# EAGLE design receiver (EAGLE 6.6.0)
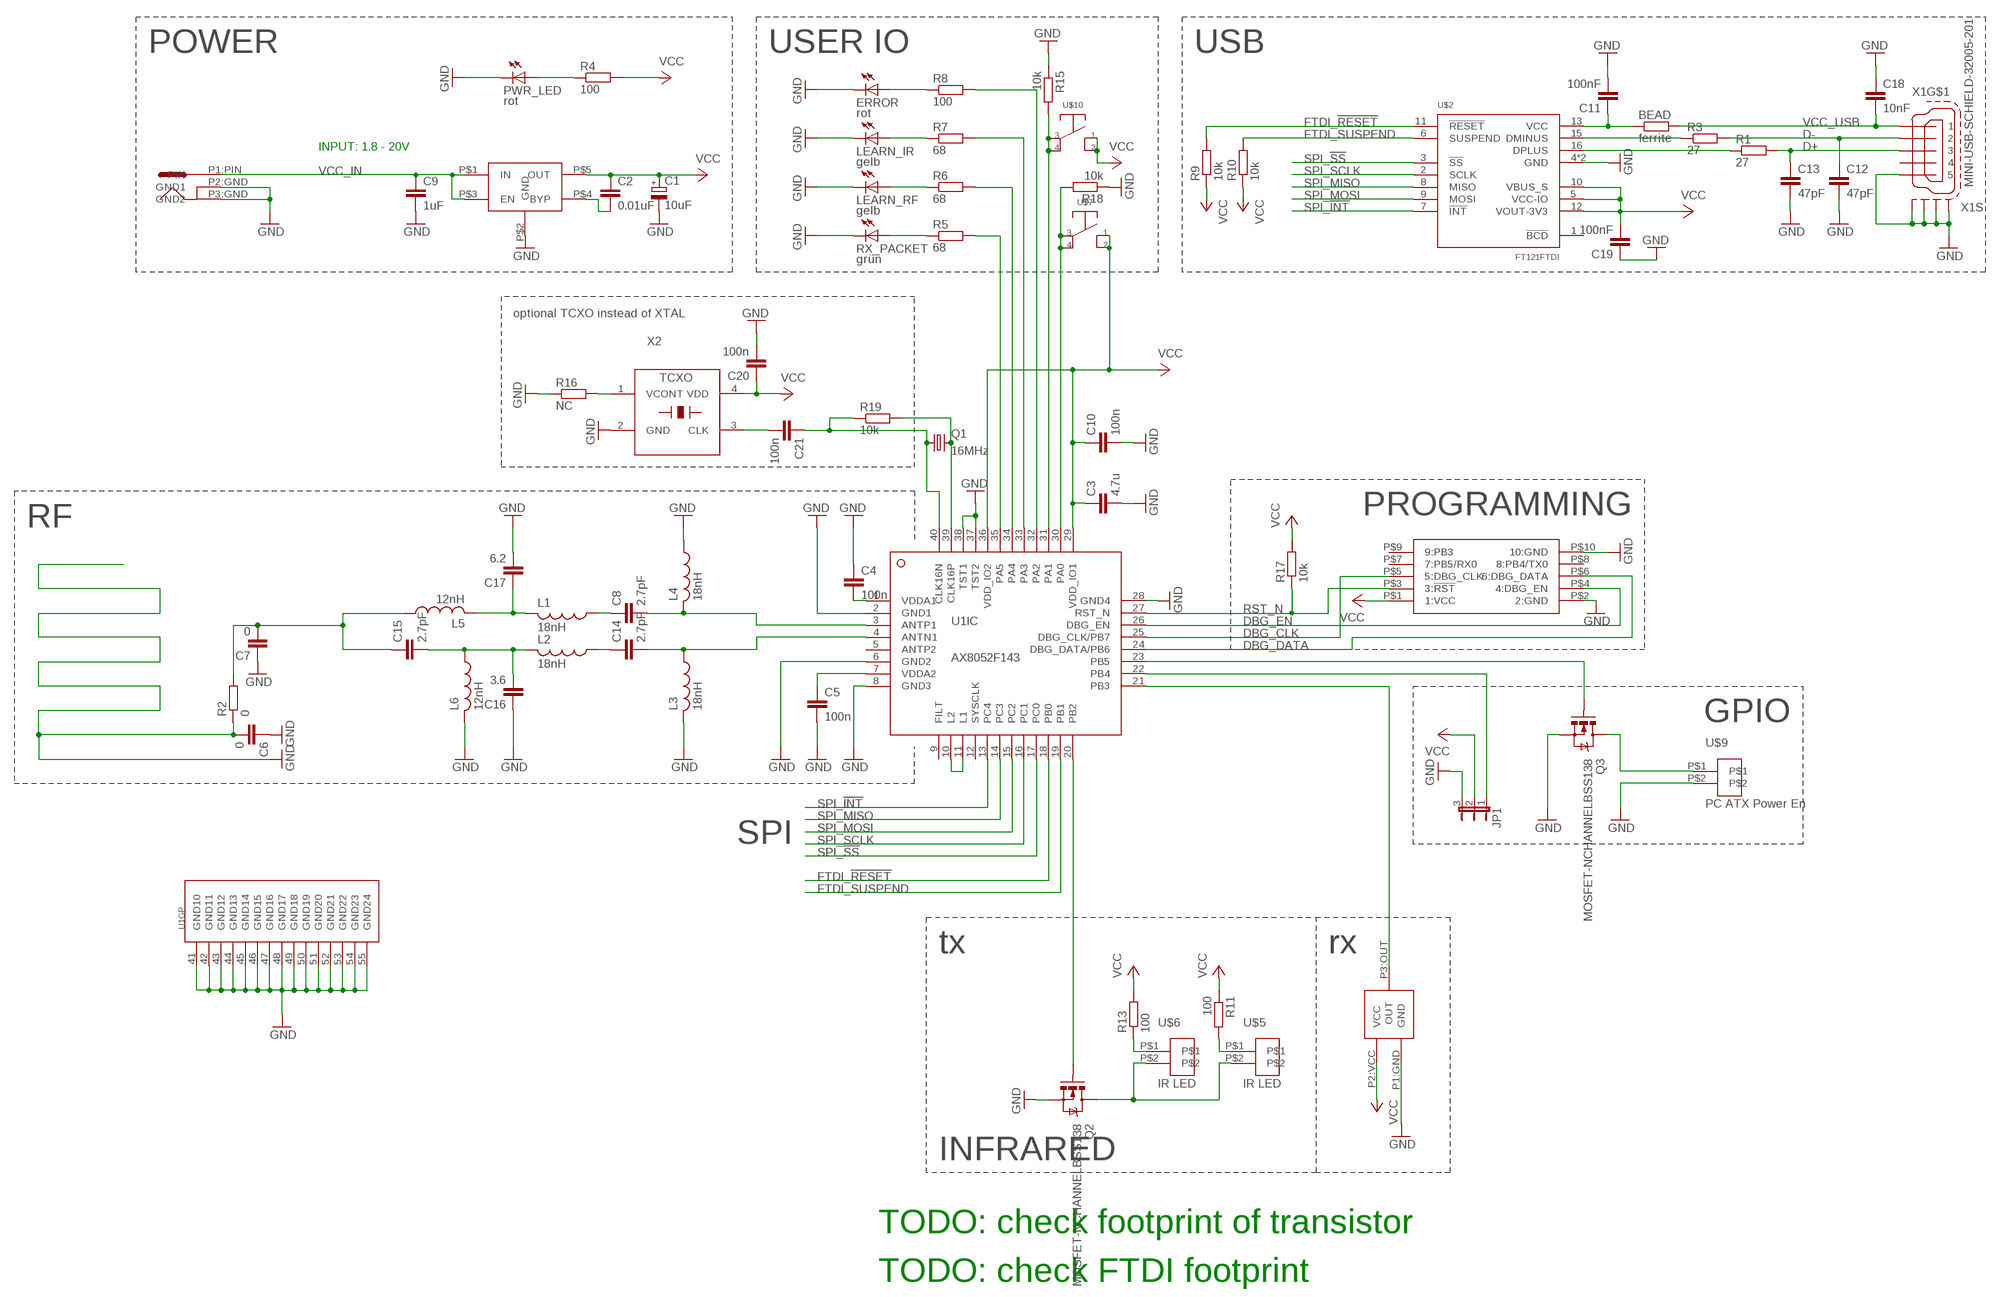
[diagram p0: schematic, sheet 1]

## Parts
BEAD  ferrite  R-EU_R0603  [R0603]
C1  10uF  CPOL-EU153CLV-0405  [153CLV-0405]
C2  0.01uF  C-EUC0603  [C0603]
C3  4.7u  C-EUC0805  [C0805]
C4  100n  C-EUC0603  [C0603]
C5  100n  C-EUC0603  [C0603]
C6  0  C-EUC0603  [C0603]
C7  0  C-EUC0603  [C0603]
C8  2.7pF  C-EUC0603  [C0603]
C9  1uF  C-EUC0805K  [C0805K]
C10  100n  C-EUC0603  [C0603]
C11  100nF  C-EUC0603K  [C0603K]
C12  47pF  C-EUC0603K  [C0603K]
C13  47pF  C-EUC0603K  [C0603K]
C14  2.7pF  C-EUC0603  [C0603]
C15  2.7pF  C-EUC0603  [C0603]
C16  3.6  C-EUC0603  [C0603]
C17  6.2  C-EUC0603  [C0603]
C18  10nF  C-EUC0603K  [C0603K]
C19  100nF  C-EUC0603K  [C0603K]
C20  100n  C-EUC0603  [C0603]
C21  100n  C-EUC0603  [C0603]
ERROR  rot  LEDCHIPLED_1206  [CHIPLED_1206]
JP1  JP2E  [JP2]
L1  18nH  L-US0603  [C0603]
L2  18nH  L-US0603  [C0603]
L3  18nH  L-US0603  [C0603]
L4  18nH  L-US0603  [C0603]
L5  12nH  L-US0603  [C0603]
L6  12nH  L-US0603  [C0603]
LEARN_IR  gelb  LEDCHIPLED_1206  [CHIPLED_1206]
LEARN_RF  gelb  LEDCHIPLED_1206  [CHIPLED_1206]
PWR_LED  rot  LEDCHIPLED_1206  [CHIPLED_1206]
Q1  16MHz  CRYSTALSM49  [SM49]
Q2  MOSFET-NCHANNELBSS138  [SOT23]
Q3  MOSFET-NCHANNELBSS138  [SOT23]
R1  27  R-EU_R0603  [R0603]
R2  0  R-EU_R0603  [R0603]
R3  27  R-EU_R0603  [R0603]
R4  100  R-EU_R0603  [R0603]
R5  68  R-EU_R0603  [R0603]
R6  68  R-EU_R0603  [R0603]
R7  68  R-EU_R0603  [R0603]
R8  100  R-EU_R0603  [R0603]
R9  10k  R-EU_R0603  [R0603]
R10  10k  R-EU_R0603  [R0603]
R11  100  R-EU_R0603  [R0603]
R13  100  R-EU_R0603  [R0603]
R15  10k  R-EU_R0603  [R0603]
R16  NC  R-EU_R0603  [R0603]
R17  10k  R-EU_R0603  [R0603]
R18  10k  R-EU_R0603  [R0603]
R19  10k  R-EU_R0603  [R0603]
RX_PACKET  grün  LEDCHIPLED_1206  [CHIPLED_1206]
U1  AX8052F143HS  [QFN40-H]
U$1  LT1761  [TSOT-23]
U$2  FT121FTDI  [TSSOP16-FTDI]
U$3  2X5PIN-CONNECTOR  [2X5PIN-CONNECTOR-SMD]
U$4  POWER_JACK  [POWER_JACK_3.4/1]
U$5  IR LED  2PIN-CONNECTOR2.57RASTER  [2PIN_PINHEADER]
U$6  IR LED  2PIN-CONNECTOR2.57RASTER  [2PIN_PINHEADER]
U$7  SWITCHSMD  [TACTILE_SWITCH_FSM2JSMA]
U$8  IR_RECEIVER  [TSOP1738_IR_RECV]
U$9  PC ATX Power En  2PIN-CONNECTOR2.57RASTER  [2PIN_PINHEADER]
U$10  SWITCHSMD  [TACTILE_SWITCH_FSM2JSMA]
X1  MINI-USB-SCHIELD-32005-201  [32005-201]
X2  TCXO3225  [X3225]

## Nets
D+: C13.1 R1.2 X1.3
D-: C12.1 R3.2 X1.2
DBG_CLK: U1.25(IC:DBG_CLK/PB7) U$3.P$5(5:DBG_CLK)
DBG_DATA: U1.24(IC:DBG_DATA/PB6) U$3.P$6(6:DBG_DATA)
DBG_EN: U1.26(IC:DBG_EN) U$3.P$4(4:DBG_EN)
FTDI_!RESET: R9.2 U1.18(IC:PB0) U$2.11(!RESET)
FTDI_SUSPEND: R10.2 U1.19(IC:PB1) U$2.6(SUSPEND)
GND: C1.- C3.2 C4.1 C5.2 C6.1 C6.2 C7.1 C9.2 C10.2 C11.2 C12.2 C13.2 C16.1 C17.2 C18.1 C19.1 C20.2 ERROR.C JP1.3 L3.2 L4.1 L6.2 LEARN_IR.C LEARN_RF.C PWR_LED.C Q2.2(S) Q3.2(S) R2.1 R15.1 R16.1 R18.1 RX_PACKET.C U1.2(IC:GND1) U1.6(IC:GND2) U1.8(IC:GND3) U1.28(IC:GND4) U1.37(IC:TST2) U1.38(IC:TST1) U1.41(GP:GND10) U1.42(GP:GND11) U1.43(GP:GND12) U1.44(GP:GND13) U1.45(GP:GND14) U1.46(GP:GND15) U1.47(GP:GND16) U1.48(GP:GND17) U1.49(GP:GND18) U1.50(GP:GND19) U1.51(GP:GND20) U1.52(GP:GND21) U1.53(GP:GND22) U1.54(GP:GND23) U1.55(GP:GND24) U$1.P$2(GND) U$2.4(GND) U$2.14(GND) U$3.P$2(2:GND) U$3.P$10(10:GND) U$4.P2:GND(GND1) U$4.P3:GND(GND2) U$8.P1:GND(GND) U$9.P$2 X1.5 X1.M1(S:S1) X1.M2(S:S2) X1.M3(S:S3) X1.M4(S:S4) X2.2(GND)
N$1: U1.10(IC:L2) U1.11(IC:L1)
N$2: R1.1 U$2.16(DPLUS)
N$3: C4.2 U1.1(IC:VDDA1)
N$4: C2.2 U$1.P$4(BYP)
N$5: R3.1 U$2.15(DMINUS)
N$6: C5.1 U1.7(IC:VDDA2)
N$7: C8.2 L4.2 U1.3(IC:ANTP1)
N$8: C14.2 L3.1 U1.4(IC:ANTN1)
N$9: C8.1 L1.1
N$10: C14.1 L2.1
N$11: BEAD.1 C11.1 U$2.13(VCC)
N$12: C17.1 L1.2 L5.2
N$13: C15.2 C16.2 L2.2 L6.1
N$14: Q1.2 R19.2 U1.39(IC:CLK16P)
N$15: C21.1 Q1.1 R19.1 U1.40(IC:CLK16N)
N$16: JP1.1 U1.22(IC:PB4)
N$17: R15.2 U1.31(IC:PA1) U$10.P3 U$10.P4
N$18: PWR_LED.A R4.1
N$19: R16.2 X2.1(VCONT)
N$20: C7.2 C15.1 L5.1 R2.2
N$21: U1.21(IC:PB3) U$8.P3:OUT(OUT)
N$22: C21.2 X2.3(CLK)
N$25: R5.1 RX_PACKET.A
N$26: R5.2 U1.35(IC:PA5)
N$27: R18.2 U1.30(IC:PA0) U$7.P3 U$7.P4
N$28: LEARN_RF.A R6.1
N$29: LEARN_IR.A R7.1
N$30: ERROR.A R8.1
N$31: R6.2 U1.34(IC:PA4)
N$32: R7.2 U1.33(IC:PA3)
N$33: R8.2 U1.32(IC:PA2)
N$37: R11.2 U$5.P$1
N$40: R13.1 U$6.P$1
N$41: Q2.3(D) U$5.P$2 U$6.P$2
N$42: Q2.1(G) U1.20(IC:PB2)
N$47: Q3.1(G) U1.23(IC:PB5)
N$48: Q3.3(D) U$9.P$1
RST_N: R17.1 U1.27(IC:RST_N) U$3.P$3(3:!RST)
SPI_!INT: U1.13(IC:PC4) U$2.7(!INT)
SPI_!SS: U1.17(IC:PC0) U$2.3(!SS)
SPI_MISO: U1.14(IC:PC3) U$2.8(MISO)
SPI_MOSI: U1.15(IC:PC2) U$2.9(MOSI)
SPI_SCLK: U1.16(IC:PC1) U$2.2(SCLK)
VCC: C1.+ C2.1 C3.1 C10.1 C19.2 C20.1 JP1.2 R4.2 R9.1 R10.1 R11.1 R13.2 R17.2 U1.29(IC:VDD_IO1) U1.36(IC:VDD_IO2) U$1.P$5(OUT) U$2.5(VCC-IO) U$2.10(VBUS_S) U$2.12(VOUT-3V3) U$3.P$1(1:VCC) U$7.P1 U$7.P2 U$8.P2:VCC(VCC) U$10.P1 U$10.P2 X2.4(VDD)
VCC_IN: C9.1 U$1.P$1(IN) U$1.P$3(EN) U$4.P1:PIN(PIN)
VCC_USB: BEAD.2 C18.2 X1.1
Unconnected: U1.5(IC:ANTP2) U1.9(IC:FILT) U1.12(IC:SYSCLK) U$2.1(!BCD) U$3.P$7(7:PB5/RX0) U$3.P$8(8:PB4/TX0) U$3.P$9(9:PB3) X1.4

## Notes on the sheet
- POWER | USER IO | USB
- INPUT: 1.8 - 20V
- optional TCXO instead of XTAL
- PROGRAMMING
- RF
- GPIO
- SPI
- tx | rx
- INFRARED
- TODO: check footprint of transistor
- TODO: check FTDI footprint

## Library data of the parts
BEAD R1-R11 R13 R15-R19 = resistor:R-EU_: RESISTOR, European symbol
C1 = resistor:CPOL-EU: POLARIZED CAPACITOR, European symbol
C2-C21 = resistor:C-EU: CAPACITOR, European symbol
ERROR LEARN_IR LEARN_RF PWR_LED RX_PACKET = led:LED: LED OSRAM: - CHIPLED LG R971, LG N971, LY N971, LG Q971, LY Q971, LO R971, LY R971 LH N974, LH R974 LS Q976, LO Q976, LY Q976 LO Q996 - Hyper CHIPLED LW Q18S LB Q993, LB Q99A, LB R99A - SideLED LS A670, LO A670, LY A670, LG A670, LP A670 LB A673, LV A673, LT A673, LW A673 LH A674 LY A675 LS A676, LA A676, LO A676, LY A676, LW A676 LS A679, LY A679, LG A679 - Hyper Micro SIDELED® LS Y876, LA Y876, LO Y876, LY Y876 LT Y87S - SmartLED LW L88C, LW L88S LB L89C, LB L89S, LG L890 LS L89K, LO L89K, LY L89K LS L896, LA L896, LO L896, LY L896 - TOPLED LS T670, LO T670, LY T670, LG T670, LP T670 LSG T670, LSP T670, LSY T670, LOP T670, LYG T670 LG T671, LOG T671, LSG T671 LB T673, LV T673, LT T673, LW T673 LH T674 LS T676, LA T676, LO T676, LY T676, LB T676, LH T676, LSB T676, LW T676 LB T67C, LV T67C, LT T67C, LS T67K, LO T67K, LY T67K, LW E67C LS E67B, LA E67B, LO E67B, LY E67B, LB E67C, LV E67C, LT E67C LW T67C LS T679, LY T679, LG T679 LS T770, LO T770, LY T770, LG T770, LP T770 LB T773, LV T773, LT T773, LW T773 LH T774 LS E675, LA E675, LY E675, LS T675 LS T776, LA T776, LO T776, LY T776, LB T776 LHGB T686 LT T68C, LB T68C - Hyper Mini TOPLED® LB M676 - Mini TOPLED Santana® LG M470 LS M47K, LO M47K, LY M47K Source: http://www.osram.convergy.de LUXEON: - LUMILED® LXK2-PW12-R00, LXK2-PW12-S00, LXK2-PW14-U00, LXK2-PW14-V00 LXK2-PM12-R00, LXK2-PM12-S00, LXK2-PM14-U00 LXK2-PE12-Q00, LXK2-PE12-R00, LXK2-PE12-S00, LXK2-PE14-T00, LXK2-PE14-U00 LXK2-PB12-K00, LXK2-PB12-L00, LXK2-PB12-M00, LXK2-PB14-N00, LXK2-PB14-P00, LXK2-PB14-Q00 LXK2-PR12-L00, LXK2-PR12-M00, LXK2-PR14-Q00, LXK2-PR14-R00 LXK2-PD12-Q00, LXK2-PD12-R00, LXK2-PD12-S00 LXK2-PH12-R00, LXK2-PH12-S00 LXK2-PL12-P00, LXK2-PL12-Q00, LXK2-PL12-R00 Source: www.luxeon.com KINGBRIGHT: KA-3528ASYC Source: www.kingbright.com
JP1 = jumper:JP2E: JUMPER
L1-L6 = resistor:L-US: INDUCTOR, American symbol
Q1 = crystal:CRYSTAL: CRYSTAL
Q2 Q3 = SparkFun-DiscreteSemi:MOSFET-NCHANNEL: Common NMOSFET Parts MFG P/N Store ID Prod ID FDD8780 TRANS-09984 SI7820DN TRANS-11055 FDS6630A IC-08089 2N7002PW TRANS-11151 FQP30N06L COM-10213 TRANS-10060 BSS123LT1G TRANS-08345 BSS138 TRANS-00830 BS170 2N7000; PROD_ID: TRANS-00830
U1 = axsem_v4-11:AX8052F143: Ultra cool AXSEM low-power narrow-band transceiver with integrated ultra-low-power AX8052 micro-controller
U$1 = sam_eagle_parts:LT1761
U$2 = sam:FT121: FT121 - USB Device Controller with SPI Slave FOOTPRINT IS PROBABLY WRONG - Use with caution! http://www.ftdichip.com/Products/ICs/FT121.html
U$3 = sam_eagle_parts:2X5PIN-CONNECTOR
U$4 = sam_eagle_parts:POWER_JACK
U$5 U$6 U$9 = sam_eagle_parts:2PIN-CONNECTOR
U$7 U$10 = sam:SWITCH
U$8 = sam_eagle_parts:IR_RECEIVER
X1 = con-cypressindustries:MINI-USB-SCHIELD-: MINI USB-B Conector Source: www.cypressindustries.com; OC_FARNELL: unknown; OC_NEWARK: unknown
X2 = axsem_osc_v1-2:TCXO

## Net classes
0 default: clearance 0.205 mm

## Board
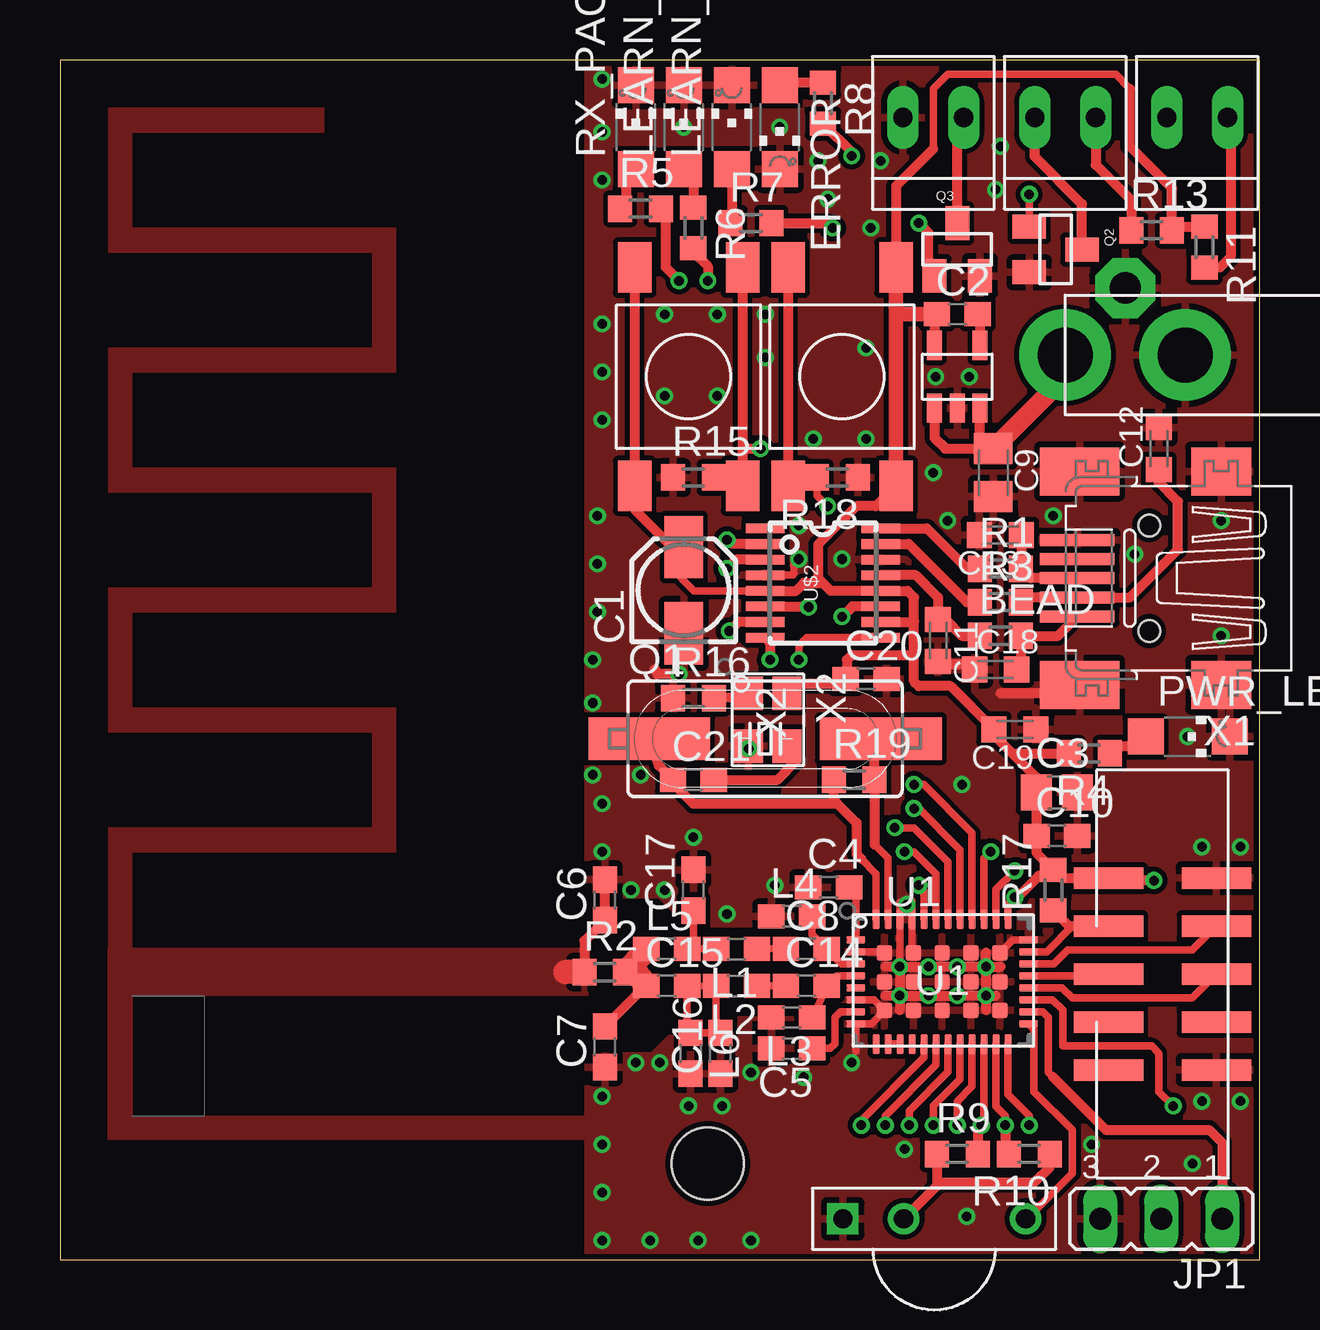
[diagram p1: board, top side]
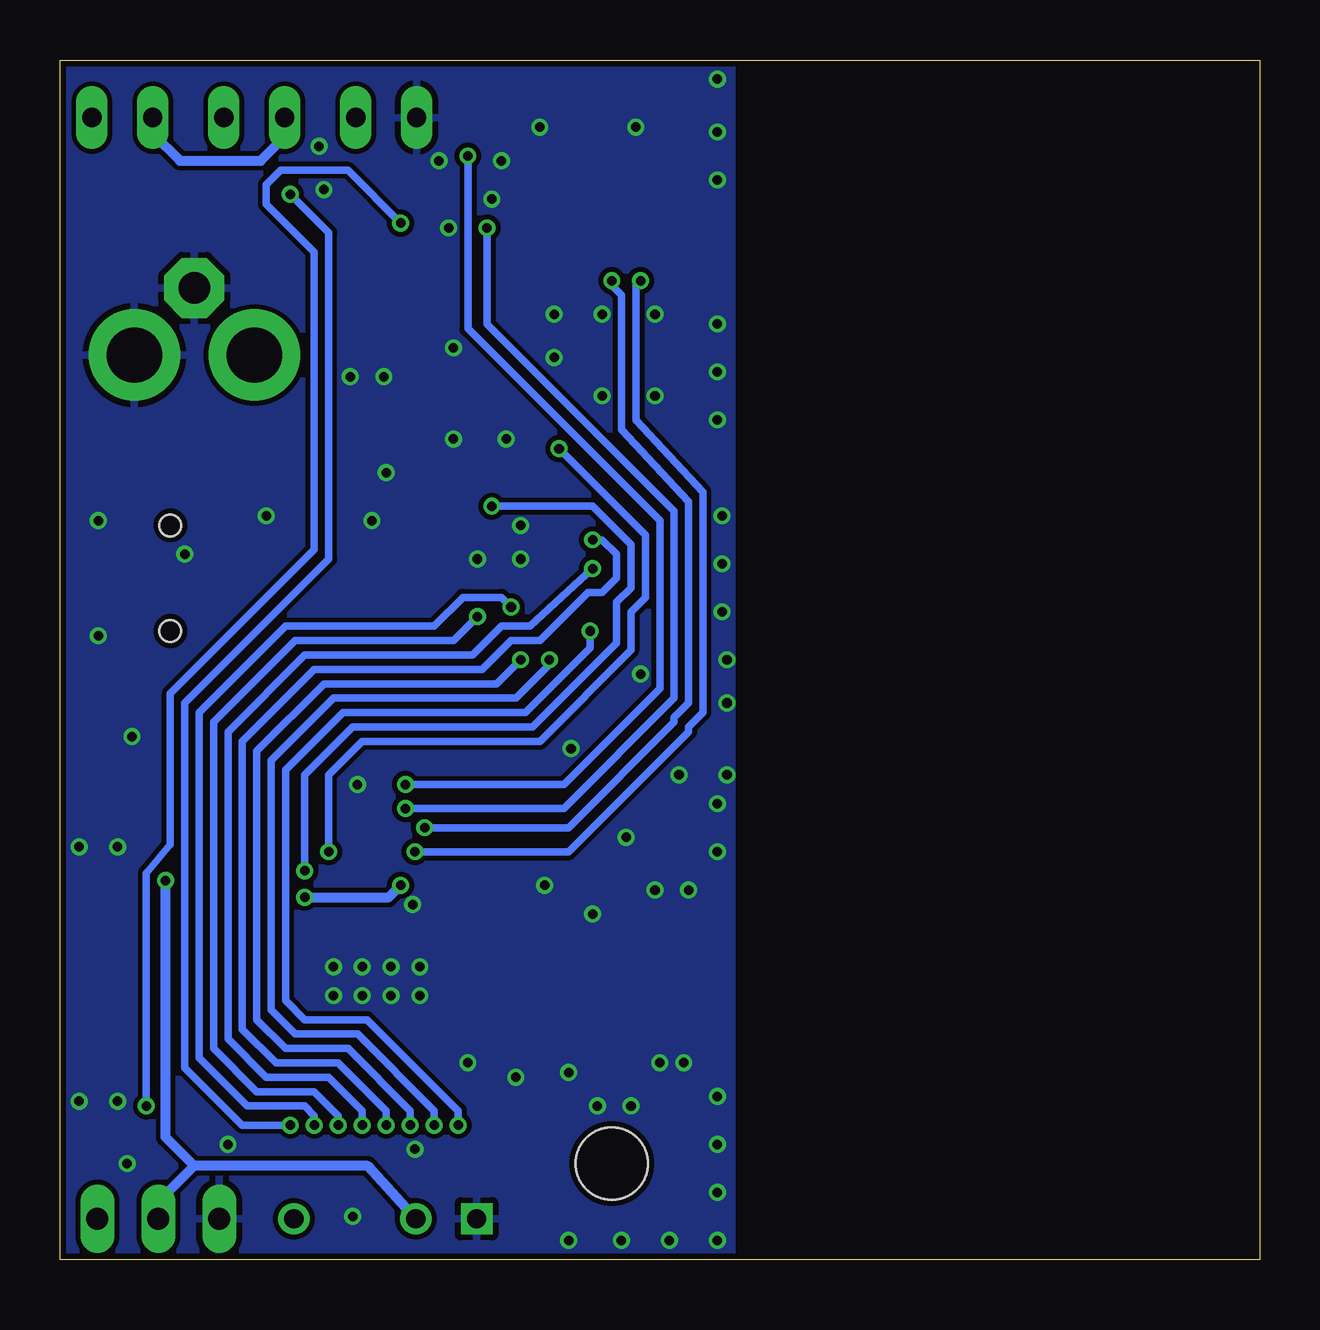
[diagram p2: board, bottom side, seen from below]

Size 50 x 50 mm. Coordinates in mm from the lower left corner, seen from the top.
Outline: 0,0 50,0 50,50 0,50 0,0
Copper layers (1*16): Top 0.035mm / dielectric 1.5mm / Bottom 0.035mm
Design rules "dirt_cheap_dirty_boards.v1": minimum track width 5mil, minimum drill 12mil, track to track 5mil, track to pad 5mil, pad to pad 5mil, via to via 5mil, smd to smd 0mil, copper to edge 10mil, drill to drill 10mil, minimum pad ring 10mil, minimum via ring 6mil, stop-mask expansion 2mil, vias tented up to drill 25mil, thermal gap 10mil
Holes 3 mm at 27,4

### Footprints (pad centres in the part's own frame; a part is rotated, then mirrored left to right if it is on the bottom)
R0603 = smd 1 x 1.1: 1 -0.85,0; 2 0.85,0
153CLV-0405 = smd 2.6 x 1.6: + 1.8,0; - -1.8,0
C0603 = smd 1.1 x 1: 1 -0.85,0; 2 0.85,0
C0805 = smd 1.3 x 1.5: 1 -0.85,0; 2 0.85,0
C0805K = smd 1.3 x 1.6: 1 -1,0; 2 1,0
C0603K = smd 1.05 x 1.08: 1 -0.875,0; 2 0.875,0
CHIPLED_1206 = smd 1.5 x 1.5: A 0,-1.75; C 0,1.75
JP2 = drill 0.914 long: 1 -2.54,0; 2 0,0; 3 2.54,0
SM49 = smd 5.08 x 1.778: 1 -4.826,0; 2 4.826,0
SOT23 = smd 1 x 1.4: 1 -0.95,-1.1; 2 0.95,-1.1; 3 0,1.1
QFN40-H = smd 0.8 x 0.3: 1 -3.6,1.75; 2 -3.6,1.25; 3 -3.6,0.75; 4 -3.6,0.25; 5 -3.6,-0.25; 6 -3.6,-0.75; 7 -3.6,-1.25; 8 -3.6,-1.75; 21 3.6,-1.75; 22 3.6,-1.25; 23 3.6,-0.75; 24 3.6,-0.25; 25 3.6,0.25; 26 3.6,0.75; 27 3.6,1.25; 28 3.6,1.75 | smd 0.3 x 0.8: 9 -2.75,-2.6; 10 -2.25,-2.6; 11 -1.75,-2.6; 12 -1.25,-2.6; 13 -0.75,-2.6; 14 -0.25,-2.6; 15 0.25,-2.6; 16 0.75,-2.6; 17 1.25,-2.6; 18 1.75,-2.6; 19 2.25,-2.6; 20 2.75,-2.6; 29 2.75,2.6; 30 2.25,2.6; 31 1.75,2.6; 32 1.25,2.6; 33 0.75,2.6; 34 0.25,2.6; 35 -0.25,2.6; 36 -0.75,2.6; 37 -1.25,2.6; 38 -1.75,2.6; 39 -2.25,2.6; 40 -2.75,2.6 | smd 0.65 x 0.65: 41 -2.4,1.2; 42 -2.4,0; 43 -2.4,-1.2; 44 -1.2,1.2; 45 -1.2,0; 46 -1.2,-1.2; 47 0,1.2; 48 0,0; 49 0,-1.2; 50 1.2,-1.2; 51 1.2,0; 52 1.2,1.2; 53 2.4,-1.2; 54 2.4,0; 55 2.4,1.2
TSOT-23 = smd 0.62 x 1.22: P$1 -0.95,-1.31; P$2 0,-1.31; P$3 0.95,-1.31; P$4 0.95,1.31; P$5 -0.95,1.31
TSSOP16-FTDI = smd 0.4 x 1.6: 1 -2.275,-2.4; 2 -1.625,-2.4; 3 -0.975,-2.4; 4 -0.325,-2.4; 5 0.325,-2.4; 6 0.975,-2.4; 7 1.625,-2.4; 8 2.275,-2.4; 9 2.275,2.4; 10 1.625,2.4; 11 0.975,2.4; 12 0.325,2.4; 13 -0.325,2.4; 14 -0.975,2.4; 15 -1.625,2.4; 16 -2.275,2.4
2X5PIN-CONNECTOR-SMD = smd 2.9 x 0.89: P$1 2.5,-4; P$2 -2,-4; P$3 2.5,-2; P$4 -2,-2; P$5 2.5,0; P$6 -2,0; P$7 2.5,2; P$8 -2,2; P$9 2.5,4; P$10 -2,4
POWER_JACK_3.4/1 = drill 2.3 pad 3.81: P1:PIN 2,0; P2:GND -3,0 | drill 1.3 pad 2.5 octagon: P3:GND -0.5,-2.8
2PIN_PINHEADER = drill 0.8 long: P$1 -1.27,0; P$2 1.27,0
TACTILE_SWITCH_FSM2JSMA = smd 1.4 x 2.1: P1 2.25,4.55; P2 2.25,-4.55; P3 -2.25,4.55; P4 -2.25,-4.55
TSOP1738_IR_RECV = drill 0.8 square: P1:GND -1.27,0 | drill 0.8: P2:VCC 1.27,0; P3:OUT 6.35,0
32005-201 = smd 3.1 x 0.5: 1 3,1.6; 2 3,0.8; 3 3,0; 4 3,-0.8; 5 3,-1.6 | smd 2.5 x 2: M1 -3,-4.45; M2 -3,4.45 | smd 3.3 x 2: M3 2.9,4.45; M4 2.9,-4.45 | hole 0.9: 0,2.2; 0,-2.2
X3225 = smd 1.4 x 1.2: 1 -1.1,-0.8; 2 1.1,-0.8; 3 1.1,0.8; 4 -1.1,0.8

### Placement (x,y rotation side)
BEAD  39.2,26 0 top
C1  26,27.9 90 top
C2  37.4,39.4 0 top
C3  41.55,19.47 0 top
C4  32.04,15.52 0 top
C5  30.5,8.8 180 top
C6  22.71,14.99 90 top
C7  22.71,8.87 90 top
C8  31.11,12.95 0 top
C9  38.9,32.8 270 top
C10  41.55,17.66 0 top
C11  36.6,25.8 270 top
C12  45.8,33.8 90 top
C13  39.2,30.2 180 top
C14  31.11,11.41 0 top
C15  25.29,11.41 0 top
C16  27.53,8.6 90 top
C17  26.4,15.4 90 top
C18  39,24.6 0 top
C19  39.8,22.1 180 top
C20  33.6,24.2 0 top
C21  26.4,20 0 top
ERROR  30,47.2 180 top
JP1  45.9,1.7 180 top
L1  28.2,12.95 180 top
L2  28.2,11.41 180 top
L3  30.5,10.1 180 top
L4  30.5,14.3 0 top
L5  25.29,12.95 0 top
L6  26.29,8.6 270 top
LEARN_IR  28,47.2 0 top
LEARN_RF  26,47.2 0 top
PWR_LED  47,21.8 270 top
Q1  29.39,21.71 0 top
Q2  41.5,42.1 270 top
Q3  37.4,42.1 0 top
R1  39.2,28.8 0 top
R2  22.71,11.98 0 top
R3  39.2,27.4 0 top
R4  42.9,21.1 180 top
R5  24.2,43.8 0 top
R6  26.4,43 270 top
R7  28.8,43.2 0 top
R8  31.8,48.2 270 top
R9  37.4,4.4 0 top
R10  40.4,4.4 180 top
R11  47.7,42.2 270 top
R13  45.5,42.9 0 top
R15  26.4,32.6 0 top
R16  26.4,23.4 0 top
R17  41.4,15.4 90 top
R18  32.4,32.6 180 top
R19  33.1,20 0 top
RX_PACKET  24,47.2 0 top
U1  36.77,11.58 0 top
U$1  37.4,36.8 0 top
U$2  31.8,28.2 270 top
U$3  46.2,11.9 180 top
U$4  43.9,37.7 180 top
U$5  47.4,47.6 180 top
U$6  41.9,47.6 180 top
U$7  32.6,36.8 0 top
U$8  33.9,1.7 0 top
U$9  36.4,47.6 180 top
U$10  26.2,36.8 180 top
U$11  [APERTURE_LOGO_BLACK]  28,11 0 bottom
X1  45.4,28.4 180 top
X2  29.5,22.5 270 top

### Tracks (layer width: path | path; a pad name or v marks a point on that pad's centre or on a via)
D+
  Top 0.406: X1.3 40.45,28.4 R1.2 40.08,28.82 C13.1
D-
  Top 0.406: R3.2 40.25,27.6 X1.2 44.6,27.6 46.6,29.6 46.6,31.6 45.8,32.4 C12.1
DBG_CLK
  Top 0.305: U1.25 43.7,11.83 U$3.P$5
DBG_DATA
  Top 0.305: U1.24 41.77,11.33 42.2,10.9 47.2,10.9 U$3.P$6
DBG_EN
  Top 0.305: U1.26 41.43,12.33 42,12.9 47.2,12.9 U$3.P$4
FTDI_!RESET  (via drill 0.4)
  Top 0.305: U1.18 38.52,5.68 v38.4,5.6
  Top 0.406: U$2.11 33.02,27.23 v32.6,26.8 | v38.4,5.6 38.25,5.45 R9.2
  Bottom 0.305: v38.4,5.6 38.4,6 39.4,7 41.8,7 43.6,8.8 43.6,22.4 40.2,25.8 33.6,25.8 v32.6,26.8
FTDI_SUSPEND  (via drill 0.4)
  Top 0.305: U1.19 39.02,6.38 39.4,6 v39.4,5.6
  Top 0.406: U$2.6 31.18,27.23 v31.2,27.2 | v39.4,5.6 39.4,4.55 R10.2
  Bottom 0.305: v39.4,5.6 39.4,6 39.8,6.4 42.2,6.4 44.2,8.4 44.2,22.8 40.6,26.4 34.4,26.4 33.2,27.6 31.6,27.6 v31.2,27.2
GND  (via drill 0.4)
  Top 0.305: 35.02,14.88 U1.38 35.02,12.52 | 35.52,14.92 U1.37 35.52,12.83 U1.44 | U1.6 33.92,10.83 U1.43 33.82,9.83 U1.8 33.17,8.67 | U1.28 39.72,13.33 U1.55 | U1.2 34.32,12.83 U1.41 | U$2.4 30.52,28.52 30.6,28.6 30.6,29 v30.8,29.2
  Top 0.406: C6.2 C6.1 21.86,13.29 R2.1 | v35,12.2 v36.2,12.2 v37.4,12.2 v38.6,12.2 | C18.1 38,24.6 37.8,24.8 36.73,24.8 C11.2 | X1.M3 42.15,23.6 39.2,23.6 | v25.8,24.4 24.9,24.4 24.8,24.6 | 34.4,11 v35,11 v36.2,11 v37.4,11 v38.6,11 39,11 | v35,12.2 34.4,12.2 | v35,12.2 35,10.4 | v38.6,12.2 39.2,12.2 | v38.6,12.2 38.6,10.4 | v38.6,12.2 38.6,12.8
  Top 1: R2.1 21.07,11.98
  other vias: 28.7,21.3 28.8,7.8 24,8.2 25,8.2 22.6,6.8 22.6,4.8 22.6,2.8 22.6,0.8 24.6,0.8 26.6,0.8 28.8,0.8 22.6,49.2 22.6,47 22.6,45 22.6,39 22.6,37 22.6,35 22.4,31 22.4,29 22.4,27 22.2,25 22.2,23.2 22.6,19 22.6,17 49.2,6.6 47.2,4 47,21.8 49.2,17.2 47.6,6.6 47.6,17.2 35.3,14.8 26,47.2 30,47.2 31.6,45.8 25.2,39.4 25.2,36 27.4,36 27.4,39.4 29.4,39.4 29.4,37.6 31.4,34.2 33.6,34.2 33.6,38 33.8,43 34.2,45.8 39,44.6 39.2,46.4 36.4,32.8 37,30.8 48.4,30.8 48.4,26 44.8,29.4 41.4,31 37.6,19.8 27.8,14.4 29.8,15.6 25.2,15.4 23.8,15.4 24.2,20.2 30.8,30.6 33,8.2 31,7.6 35.2,4.6 37.8,1.8 43,4.8 32.6,29.2 32,44.2 22.2,20.2 37.9,36.8 36.5,36.8 27.6,6.4 26.2,6.4 26.4,17.6
  pour Top: 22,13 22,11 3,11 3,6 22,6 22,5 2,5 2,13
  pour Top: 3,12 3,17 14,17 14,23 3,23 3,27 14,27 14,33 3,33 3,37 14,37 14,43 3,43 3,47 11,47 11,48 2,48 2,42 13,42 13,38 2,38 2,32 13,32 13,28 2,28 2,22 13,22 13,18 2,18 2,12
  pour Top: 22,0 22,8.5 24.7,8.5 26.2,10 32.1,10 32.1,14 26.2,14 25,15.2 22,15.2 22,50 50,50 50,0
  pour Bottom: 22,50 50,50 50,0 22,0
N$1
  Top 0.3: U1.11 U1.10
N$2
  Top 0.406: R1.1 37.8,28.8 36.12,30.48 U$2.16
N$3
  Top 0.305: C4.2 33.17,15.24 U1.1
N$4
  Top 0.305: C2.2 38.35,39.7
  Top 0.406: 38.35,39.7 U$1.P$4
N$5
  Top 0.406: R3.1 37.8,27.4 35.38,29.82 U$2.15
N$6
  Top 0.305: U1.7 32.53,10.33 32.3,10.1 32.3,9 32.1,8.8 C5.1
N$7
  Top 0.305: L4.2 31.35,13.56 C8.2 32.58,12.33 U1.3
N$8
  Top 0.305: U1.4 32.38,11.83 C14.2 31.65,10.7 L3.1
N$9
  Top 0.3: C8.1 L1.1
N$10
  Top 0.305: L2.1 C14.1
N$11
  Top 0.406: BEAD.1 37.6,26 36.92,26.68 C11.1 36.6,27.6 35.67,28.52 U$2.13
N$12
  Top 0.3: L1.2 L5.2
  Top 0.305: C17.1 26.4,13.21 L5.2
N$13
  Top 0.3: C15.2 L2.2
  Top 0.305: C15.2 26.14,9.6 L6.1 C16.2 | L2.2 27.35,9.95 27.9,9.4
N$14
  Top 0.305: U1.39 34.52,16.73 33.95,17.3
  Top 0.406: Q1.2 33.95,21.58 R19.2 33.95,17.3
N$15
  Top 0.305: U1.40 34.02,16.08 33.4,16.7
  Top 0.406: 32.4,19 26.4,19 25.55,19.85 C21.1 24.96,20.59 Q1.1 | 32.4,19 33.2,18.2 33.2,16.9 33.4,16.7 | 32.4,19 32.25,19.15 R19.1
N$16
  Top 0.305: U1.22 40.97,10.33 41.2,10.1 41.2,7.8 41.4,7.6
  Top 0.406: 41.4,7.6 43.6,5.4 47.9,5.4 48.44,4.86 JP1.1
N$17  (via drill 0.4)
  Top 0.305: v38.8,17 38.52,16.72 U1.31
  Top 0.406: U$10.P4 28.45,33.6 | 28.45,33.6 U$10.P3 28.1,32.6 R15.2 | 28.45,33.6 28.45,33.8 v29.2,33.8
  Bottom 0.305: v29.2,33.8 25.6,30.2 25.6,27.6 26.2,27 26.2,25.4 30,21.6 37.4,21.6 38.8,20.2 v38.8,17
N$18
  Top 0.406: R4.1 44.05,21.4 44.85,21.4 PWR_LED.A
N$19
  Top 0.406: R16.2 29,23.5 X2.1
N$20
  Top 0.406: C15.1 24.4,11.41 C7.2
  Top 1: L5.1 23.8,12.2 C15.1
  Top 1.016: R2.2 23.8,12.2
N$21
  Top 0.305: U1.21 40.6,9.6 40.6,7 42.2,5.4 42.2,3.6 40.3,1.7 U$8.P3:OUT
N$22
  Top 0.406: C21.2 29.9,20 30.7,20.8 X2.3
N$25
  Top 0.406: RX_PACKET.A 23.6,45.05 23.6,44.05 R5.1
N$26  (via drill 0.4)
  Top 0.305: U1.35 36.52,16.08 35.6,17 v35.2,17
  Top 0.406: v25.8,40.8 25.25,41.35 25.25,43.6 R5.2
  Bottom 0.305: v35.2,17 28.8,17 23.8,22 23.8,22.2 23.2,22.8 23.2,32 26,35 26,40.6 v25.8,40.8
N$27  (via drill 0.4)
  Top 0.305: R18.2 31.55,31.85 v32,31.4 | v39.8,16.2 39.02,15.42 U1.30
  Top 0.406: R18.2 30.7,32.6 U$7.P4 U$7.P3
  Bottom 0.305: v32,31.4 27.8,31.4 26.2,29.8 26.2,28 26.8,27.4 26.8,25.7 30.3,22.2 37.8,22.2 39.8,20.2 v39.8,16.2
N$28
  Top 0.406: LEARN_RF.A 26.4,45.05 R6.1
N$29
  Top 0.406: LEARN_IR.A 28,43.25 R7.1
N$30
  Top 0.406: R8.1 30.3,49.05 ERROR.A
N$31  (via drill 0.4)
  Top 0.305: U1.34 37.02,16.58 35.6,18 v34.8,18
  Top 0.406: R6.2 26.4,42 27,41.4 v27,40.8
  Bottom 0.305: v34.8,18 28.8,18 24.4,22.4 24.4,22.6 23.8,23.2 23.8,31.6 26.6,34.6 26.6,40.2 27,40.6 v27,40.8
N$32  (via drill 0.4)
  Top 0.305: U1.33 37.52,17.08 35.8,18.8 v35.6,18.8
  Top 0.406: R7.2 32,43.2 v32.2,43
  Bottom 0.305: v35.6,18.8 29,18.8 24.4,23.4 24.4,31.2 32.2,39 v32.2,43
N$33  (via drill 0.4)
  Top 0.305: U1.32 38.02,17.78 36,19.8 v35.6,19.8
  Top 0.406: R8.2 33,46.15 v33,46
  Bottom 0.305: v35.6,19.8 29,19.8 25,23.8 25,30.8 33,38.8 v33,46
N$37
  Top 0.406: U$5.P$1 48.8,47.47 48.8,41.8 48.35,41.35 R11.2
N$40
  Top 0.406: U$6.P$1 43.17,45.63 44.65,44.15 R13.1
N$41
  Top 0.406: Q2.3 42.6,44 40.63,45.97 U$6.P$2
  Bottom 0.406: U$5.P$2 46.13,46.93 45,45.8 41.63,45.8 40.63,46.8 U$6.P$2
N$42  (via drill 0.4)
  Top 0.305: U1.20 39.52,6.88 40.4,6 v40.4,5.6 | Q2.1 v40.4,44.4
  Bottom 0.305: v40.4,5.6 42.4,5.6 44.8,8 44.8,23.2 38.8,29.2 38.8,42.8 v40.4,44.4
N$47  (via drill 0.4)
  Top 0.305: v46.4,6.4 45.8,7 45.8,8.6 45.5,8.9 41.8,8.9 41.8,10.4 41.37,10.83 U1.23
  Top 0.406: Q3.1 36.2,41.25 36.2,42.8 v35.8,43.2
  Bottom 0.305: v35.8,43.2 38,45.4 40.8,45.4 41.4,44.8 41.4,44 39.4,42 39.4,29.6 45.4,23.6 45.4,17.3 46.4,16.1 v46.4,6.4
N$48
  Top 0.406: Q3.3 37.4,47.33 U$9.P$1
RST_N
  Top 0.305: U1.27 41.13,12.83 42.2,13.9
  Top 0.406: R17.1 42.05,13.9 42.2,13.9 U$3.P$3
SPI_!INT  (via drill 0.4)
  Top 0.305: U1.13 36.02,8.42 33.4,5.8 v33.4,5.6
  Top 0.406: U$2.7 28.27,26.57 v27.9,26.2
  Bottom 0.305: v33.4,5.6 33.4,6.2 37.2,10 39.8,10 40.6,10.8 40.6,20.4 38.2,22.8 30.6,22.8 27.9,25.5 v27.9,26.2
SPI_!SS  (via drill 0.4)
  Top 0.305: U1.17 38.02,7.22 37.4,6.6 v37.4,5.6
  Top 0.406: U$2.3 28.18,29.18 v27.8,28.8
  Bottom 0.305: v37.4,5.6 37.4,6.2 38.8,7.6 41.4,7.6 43,9.2 43,22 39.8,25.2 32.8,25.2 31.6,26.4 30.4,26.4 v27.8,28.8
SPI_MISO  (via drill 0.4)
  Top 0.305: U1.14 36.52,8.12 34.4,6 v34.4,5.6
  Top 0.406: U$2.8 29.6,25.73 v29.6,25
  Bottom 0.305: v34.4,5.6 34.4,6.2 37.6,9.4 40.2,9.4 41.2,10.4 41.2,20.8 38.6,23.4 31,23.4 29.6,24.8 v29.6,25
SPI_MOSI  (via drill 0.4)
  Top 0.305: v35.4,5.6 35.4,6.2 37.02,7.82 U1.15 | U$2.9 31.12,25.93 30.8,25.6 v30.8,25
  Bottom 0.305: v35.4,5.6 35.4,6.2 38,8.8 40.6,8.8 41.8,10 41.8,21.2 39,24 31.8,24 v30.8,25
SPI_SCLK  (via drill 0.4)
  Top 0.305: v36.4,5.6 36.4,6.4 37.52,7.52 U1.16
  Top 0.406: U$2.2 28.02,29.82 v27.8,30
  Bottom 0.305: v36.4,5.6 36.4,6.2 38.4,8.2 41,8.2 42.4,9.6 42.4,21.6 39.4,24.6 32.4,24.6 31.2,25.8 30,25.8 28,27.8 27.4,27.8 26.8,28.4 26.8,29.4 27.4,30 v27.8,30
VCC  (via drill 0.4)
  Top 0.305: U1.29 39.52,14.82 v39.8,15.1 | U1.36 36.02,15.38 v35.8,15.6 | 36.45,39.7 C2.1 | U$2.5 26.43,27.88 25.4,28.9 25.4,29.5 C1.+ | 44.6,48.8 44,49.4 37,49.4 36.4,48.8 36.4,46.3
  Top 0.406: R17.2 40.7,16.95 C10.1 C3.1 40.7,20.1 39.7,21.1 | 35.6,25.2 35.6,26.6 | 35.6,26.6 35.6,27.6 35.33,27.88 U$2.12 32.12,27.88 31.8,28.2 | 39.7,21.1 R4.2 | U$2.10 35.58,26.57 35.6,26.6 | R17.2 41.75,15.9 U$3.P$1 | R9.1 36.55,3.08 | 36.55,3.08 U$8.P2:VCC | R10.1 41.25,3.85 40.6,3.2 36.67,3.2 36.55,3.08 | 43.8,16 U$3.P$1 | v45.6,15.8 43.8,15.8 U$3.P$1 | 36.45,39.7 U$1.P$5 | U$7.P1 34.85,44.75 36.4,46.3 | U$10.P2 U$10.P1 24,32.2 24,31.2 25.5,29.7 C1.+ | U$7.P2 34,31.4 33.2,31.4 31.6,29.8 31.6,28.4 31.8,28.2 | 35.6,25.2 35.6,24.1 35.8,23.9 37.12,23.9 C19.2 38.92,21.88 39.7,21.1 | U$2.5 30.68,27.88 31,28.2 31.8,28.2 | R11.1 46.5,43.05 R13.2 46.35,44.65 44.6,46.4 44.6,48.8 | 35.6,25.2 33,25.2 32.8,25 32.8,24.35 C20.1 32.45,24 30.7,24 X2.4 | R17.2 41.15,16 40.8,16 39.9,15.1 v39.8,15.1
  Top 0.61: U$7.P2 34.85,39.4 | 34.85,39.4 U$7.P1 | C2.1 34.85,39.4
  Bottom 0.406: U$8.P2:VCC 37.17,3.9 44.4,3.9 | 44.4,3.9 45.9,2.4 JP1.2 | 44.4,3.9 45.6,5.1 v45.6,15.8 | v39.8,15.1 36.3,15.1 v35.8,15.6
VCC_IN
  Top 0.406: U$1.P$1 36.45,34.25 36.9,33.8 C9.1 38.35,33.85 U$1.P$3
  Top 0.813: C9.1 41.9,36.8 U$4.P1:PIN
VCC_USB
  Top 0.406: X1.1 41.6,26 BEAD.2 40.05,24.62 C18.2

### Text on the board
bDocu: Samuel Bryner (2014, rev 2) | AXreceiver